# Altium schematic sheet Fuentes.SchDoc
size A4; DocumentNumber: 7; SheetNumber: 7; SheetTotal: 7
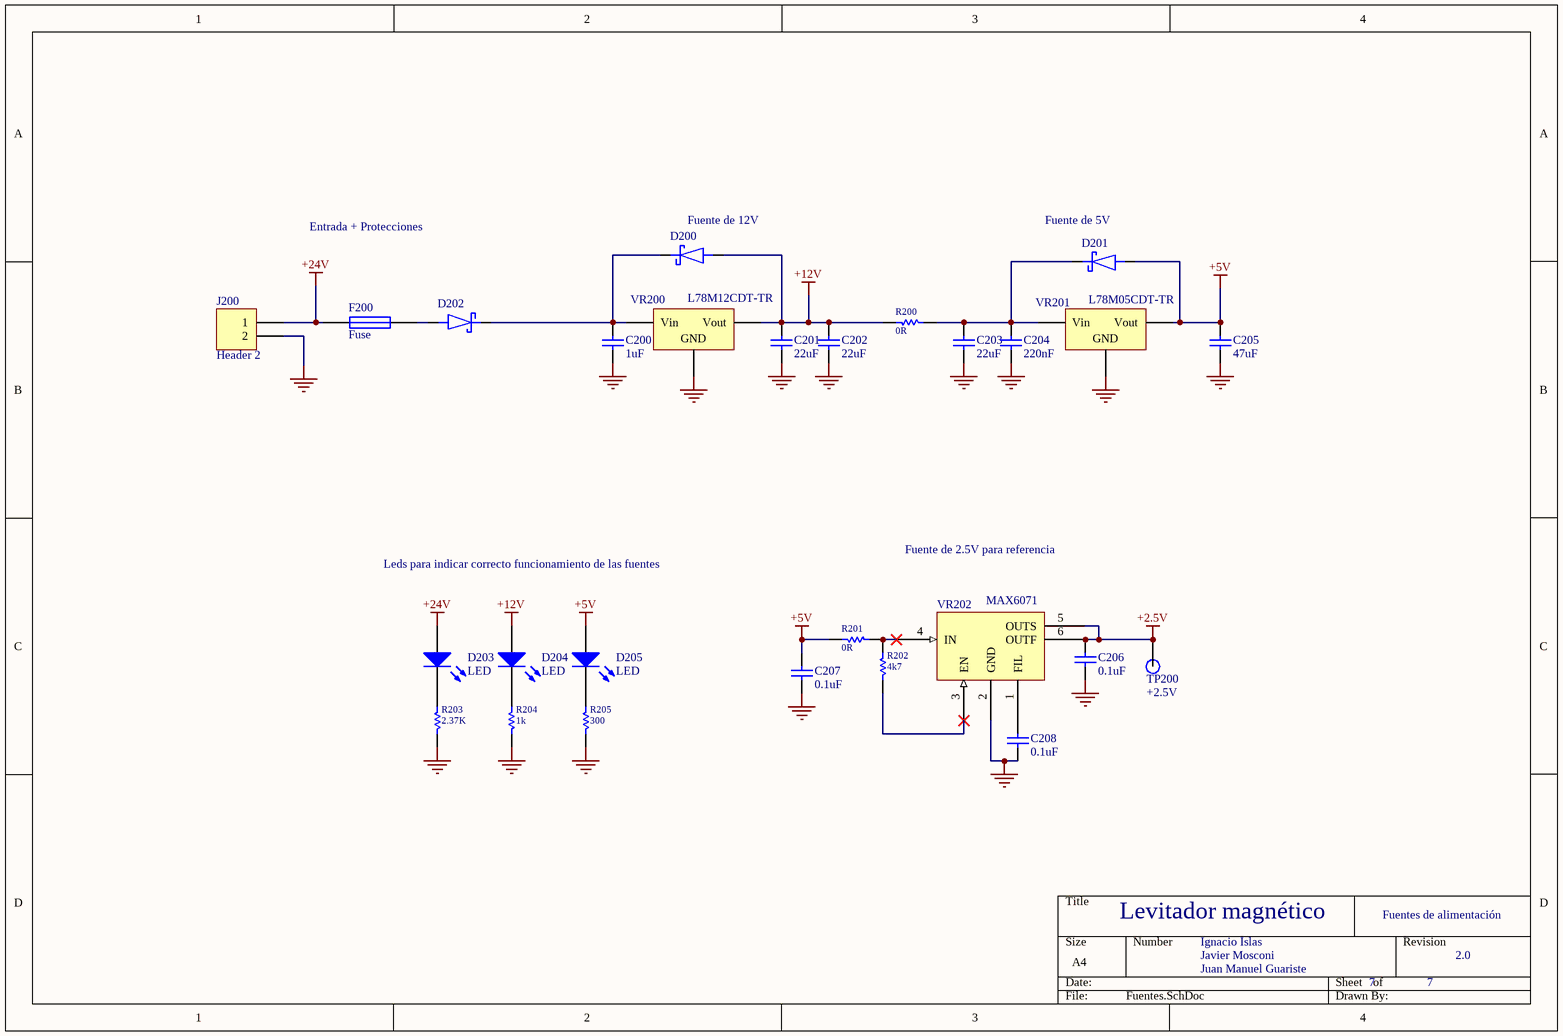
[diagram p0: Fuentes.SchDoc]

## Parts
C200  value 1uF  [C1206]  (hidden comment: Capacitor)
C201  value 22uF  [C1206]  (hidden comment: Capacitor)
C202  value 22uF  [C1206]  (hidden comment: Capacitor)
C203  value 22uF  [C1206]  (hidden comment: Capacitor)
C204  value 220nF  [C1206]  (hidden comment: Capacitor)
C205  value 47uF  [C1206]  (hidden comment: Capacitor)
C206  value 0.1uF  [C1206]  (hidden comment: Capacitor)
C207  value 0.1uF  [C1206]  (hidden comment: Capacitor)
C208  value 0.1uF  [C1206]  (hidden comment: Capacitor)
D200  RSX205LAM30TR  [SODFL4725X105N]  (value not drawn)
D201  RSX205LAM30TR  [SODFL4725X105N]  (value not drawn)
D202  RSX205LAM30TR  [SODFL4725X105N]  (value not drawn)
D203  LED  [LED 1206 RED]
D204  LED  [LED 1206 RED]
D205  LED  [LED 1206 RED]
F200  Fuse  [R1206]
J200  Header 2  [SMKDS5-2-9.5]
R200  0R  [R1206]
R201  0R  [R1206]
R202  4k7  [R1206]
R203  2.37K  [R1206]
R204  1k  [R1206]
R205  300  [R1206]
TP200  +2.5V  [TestPoint Keystone 5000 Silver-Red]
VR200  L78M12CDT-TR  [TO252-AA]
VR201  L78M05CDT-TR  [TO252-AA]
VR202  MAX6071  [SOT23-6]

## Nets
+2.5V: C206.2 TP200.1 VR202.5(OUTS) VR202.6(OUTF)
+5V: C205.2 C207.2 D201.2(A) D205.1(A) R201.2 VR201.3(Vout)
+12V: C201.2 C202.2 D200.2(A) D204.1(A) R200.2 VR200.3(Vout)
+24V: D203.1(A) F200.1 J200.1
GND: C200.1 C201.1 C202.1 C203.1 C204.1 C205.1 C206.1 C207.1 C208.1 J200.2 R203.1 R204.2 R205.1 VR200.2(GND) VR201.2(GND) VR202.2(GND)
NetC200_2: C200.2 D200.1(K) D202.1(K) VR200.1(Vin)
NetC203_2: C203.2 C204.2 D201.1(K) R200.1 VR201.1(Vin)
NetC208_2: C208.2 VR202.1(FIL)
NetD202_2: D202.2(A) F200.2
NetD203_2: D203.2(K) R203.2
NetD204_2: D204.2(K) R204.1
NetD205_2: D205.2(K) R205.2
NetR201_1: R201.1 R202.2 VR202.4(IN)
NetR202_1: R202.1 VR202.3(EN)

## Notes on the sheet
- Entrada + Protecciones
- (near D200) Fuente de 12V
- (near D201) Fuente de 5V
- Leds para indicar correcto funcionamiento de las fuentes
- Fuente de 2.5V para referencia
- Levitador magnético
- Fuentes de alimentación
- Ignacio Islas
- Javier Mosconi
- Juan Manuel Guariste
- 2.0

## Library data of the parts
C200 = Capacitor: CAP CER 1UF 25V X7R 1206; Manufacturer: CAL-CHIP ELECTRONICS, INC.; Mfr PN: GMC31X7R105M25NT; Supplier 1: Digi-Key; Supplier 1 PN: 2571-GMC31X7R105M25NTTR-ND
C201-C203 = Capacitor: CAP CER 22UF 16V X5R 1206; Manufacturer: Samsung Electro-Mechanics; Mfr PN: CL31A226MOCLNNC; Supplier 1: Digi-Key; Supplier 1 PN: 1276-2728-1-ND
C204 = Capacitor: CAP CER 0.22UF 50V X7R 1206; Mfr PN: CL31B224KBFNNNE; Manufacturer: Samsung Electro-Mechanics; Supplier 1: Digi-Key; Supplier 1 PN: 1276-1106-1-ND
C205 = Capacitor: CAP CER 47UF 10V X5R 1206; Manufacturer: Taiyo Yuden; Mfr PN: LMK316BJ476ML-T; Supplier 1: Digi-Key; Supplier 1 PN: 587-1780-1-ND
C206 C208 = Capacitor: CAP CER 0.1UF 50V X7R 1206; Mfr PN: C1206X7R500-104KNE; Manufacturer: Venkel; Supplier 1: Digi-Key; Supplier 1 PN: 2679-C1206X7R500-104KNETR-ND
C207 = Capacitor: CAP CER 0.1UF 50V X7R 1206; Manufacturer: Venkel; Mfr PN: C1206X7R500-104KNE; Supplier 1: Digi-Key; Supplier 1 PN: 2679-C1206X7R500-104KNETR-ND
D200-D202 = RSX205LAM30TR: DIODE SCHOTTKY 30V 2A PMDTM; Manufacturer: ROHM Semiconductor; Mfr PN: RSX205LAM30TR; Supplier 1 PN: RSX205LAM30CT-ND; Supplier 1: Digi-Key
D203-D205 = LED: 1206 RED SMD LED; Manufacturer: American Opto Plus LED; Mfr PN: L152L-LIC; Supplier 1: Digi-Key; Supplier 1 PN: 2460-L152L-LICTR-ND
F200 = Fuse: FUSE 500MA 125VAC FAST 1206; Mfr PN: C1F 500; Manufacturer: Bel Fuse Inc.; Supplier 1 PN: 507-1876-1-ND; Supplier 1: Digi-Key; Datasheet: https://belfuse.com/resources/datasheets/circuitprotection/ds-cp-c1f-series.pdf
J200 = Header 2: TERM BLK 2P SIDE ENT 2.54MM PCB; Manufacturer: TE Connectivity AMP Connectors; Mfr PN: 282834-2; Supplier 1: Digi-Key; Link: https://www.digikey.com/en/products/detail/te-connectivity-amp-connectors/282834-2/1150135; Supplier 1 PN: A98333-ND
R200 R201 = R1206: RES 0 OHM JUMPER 1/4W 1206; Mfr PN: RMCF1206ZT0R00; Manufacturer: Stackpole Electronics Inc; Supplier 1 PN: RMCF1206ZT0R00CT-ND; Supplier 1: Digi-Key; Value: 0R
R202 = R1206: RES 4.7K OHM 1% 1/4W 1206; Mfr PN: RMCF1206FT4K70; Manufacturer: Stackpole Electronics Inc; PackageReference: 1206; Supplier 1 PN: RMCF1206FT4K70CT-ND; Supplier 1: Digi-Key; Value: 4k7; Tolerance: 1%
R203 = R1206: RES 2.37K OHM 1% 1/4W 1206; Mfr PN: RMCF1206FG2K37; Manufacturer: Stackpole Electronics Inc; Supplier 1: Digi-Key; Value: 2.37K; Tolerance: 1%; Supplier 1 PN: RMCF1206FG2K37CT-ND
R204 = R1206: RES 1K OHM 1% 1/4W 1206; Mfr PN: RMCF1206FT1K00; Manufacturer: Stackpole Electronics Inc; Supplier 1 PN: RMCF1206FT1K00CT-ND; Supplier 1: Digi-Key; Value: 1k; Tolerance: 1%
R205 = R1206: RES 300 OHM 1% 1/4W 1206; Mfr PN: RC1206FR-10300RL; Manufacturer: YAGEO; Supplier 1 PN: 13-RC1206FR-10300RLCT-ND; Supplier 1: Digi-Key; Value: 300; Tolerance: 1%
TP200 = Testpoint: PC TEST POINT MINIATURE RED; Manufacturer: Keystone Electronics; Mfr PN: 5000; Link: https://www.digikey.com/en/products/detail/keystone-electronics/5000/255326; Supplier 1: Digi-Key; Supplier 1 PN: 36-5000-ND
VR200 = Volt Reg: Voltage Regulator; Manufacturer: STMicroelectronics; Supplier 1: Digi-Key; Mfr PN: L78M12CDT-TR; Supplier 1 PN: 497-1211-1-ND
VR201 = Volt Reg: IC REG LINEAR 5V 500MA DPAK; Manufacturer: STMicroelectronics; Supplier 1: Digi-Key; Mfr PN: L78M05CDT-TR; Supplier 1 PN: 497-1203-1-ND
VR202 = MAX6071: IC VREF SERIES 0.08% SOT23-6; Manufacturer: Analog Devices Inc./Maxim Integrated; Mfr PN: MAX6071BAUT41+T; Supplier 1: Digi-Key; Datasheet: https://ar.mouser.com/datasheet/2/256/MAX6070_MAX6071-217862.pdf; Supplier 1 PN: MAX6071BAUT41+TCT-ND